# EAGLE design RH021.1 (EAGLE 7.1.0)
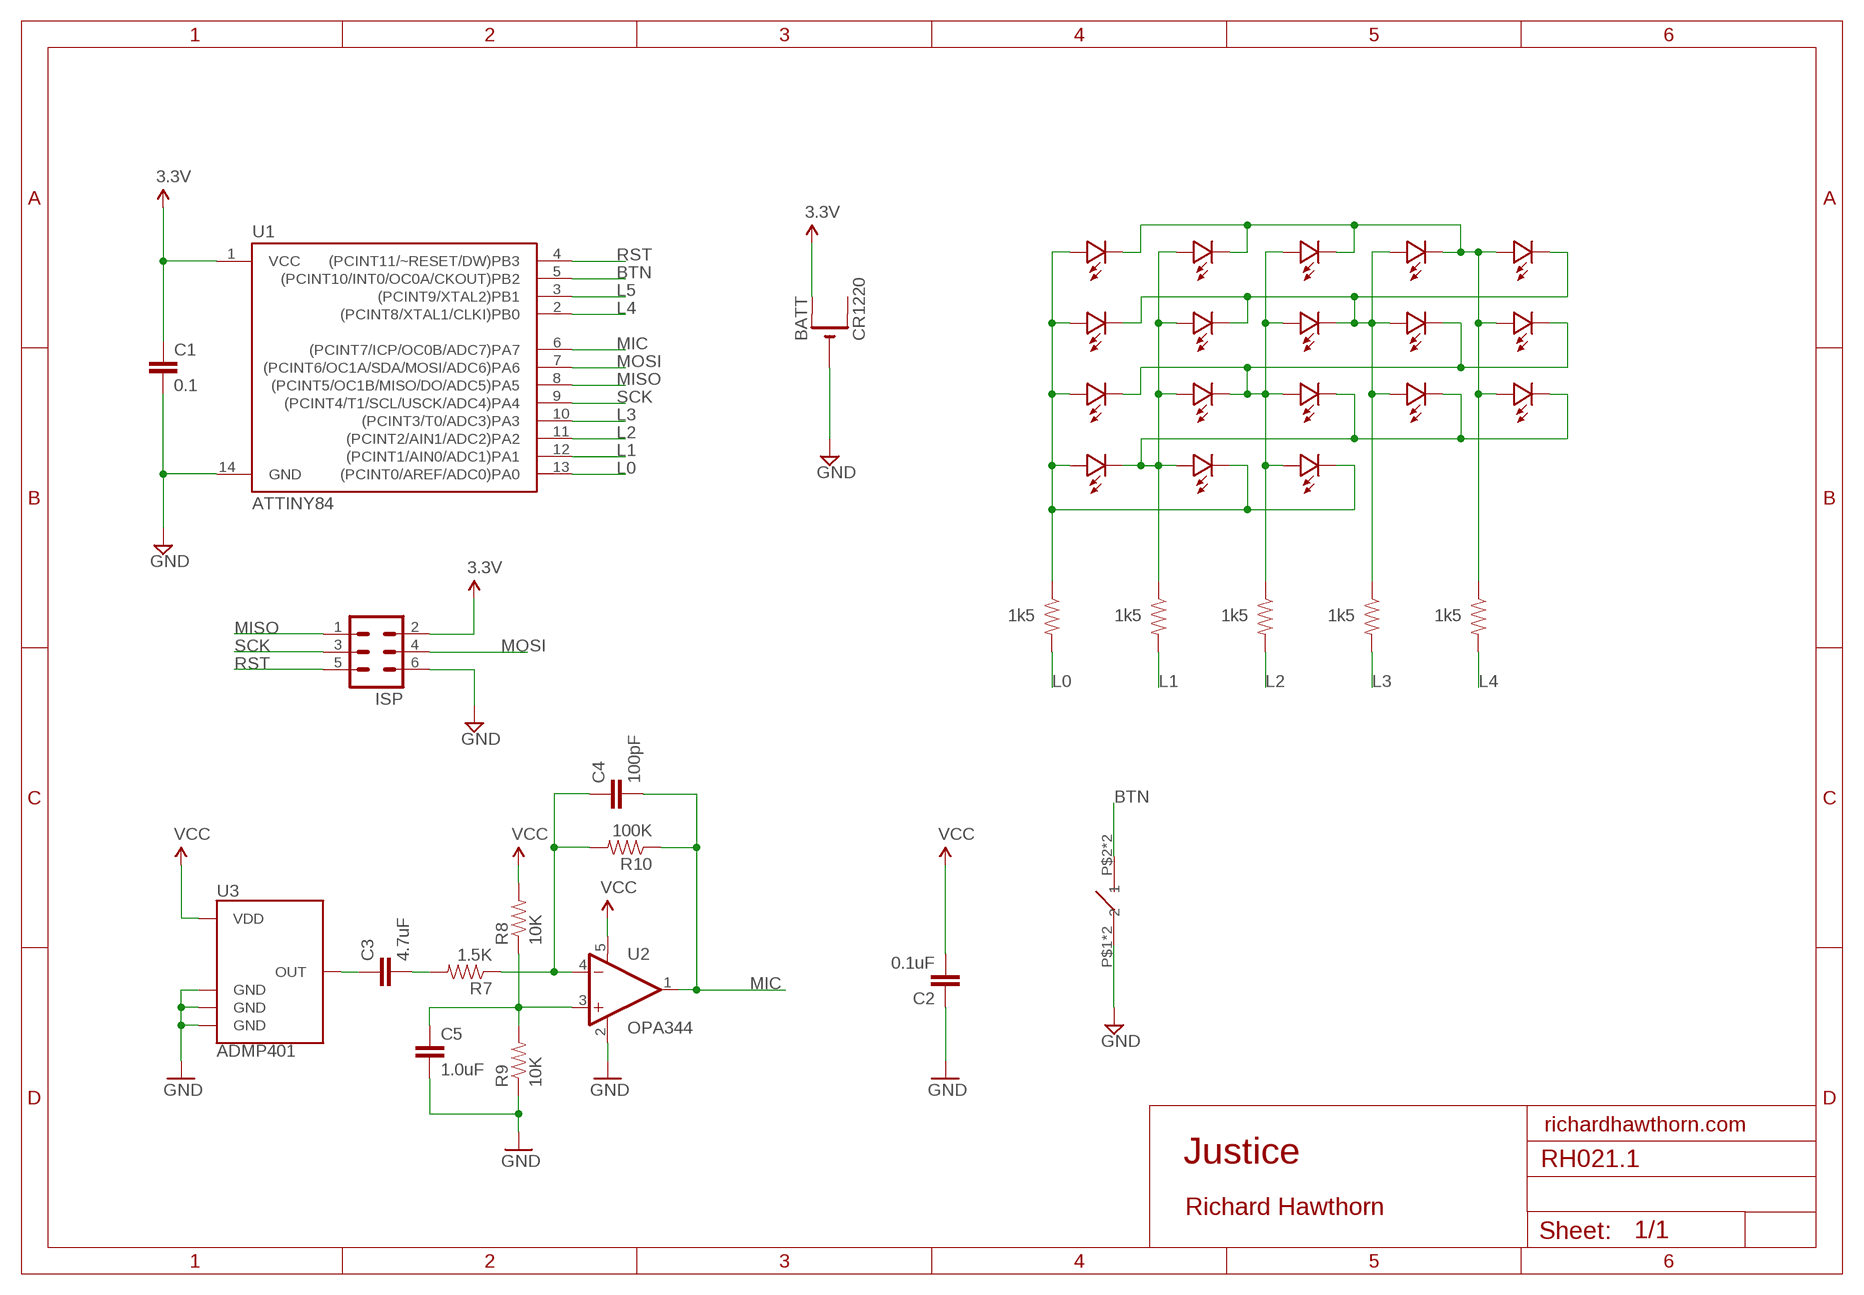
[diagram p0: schematic, sheet 1]

## Parts
BATT  CR1220  CR1220SMT  [CR1220-SMD]
BTN1  TURTLE-3PIN  [TURTLE-3PIN]
C1  0.1  CAP0603-CAP  [0603-CAP]
C2  0.1uF  CAP0402-CAP  [0402-CAP]
C3  4.7uF  CAP0402-CAP  [0402-CAP]
C4  100pF  CAP0402-CAP  [0402-CAP]
C5  1.0uF  CAP0402-CAP  [0402-CAP]
ISP  MA03-2  [MA03-2]
LED1  LED0603  [0603-LED]
LED2  LED0603  [0603-LED]
LED3  LED0603  [0603-LED]
LED4  LED0603  [0603-LED]
LED5  LED0603  [0603-LED]
LED6  LED0603  [0603-LED]
LED7  LED0603  [0603-LED]
LED8  LED0603  [0603-LED]
LED9  LED0603  [0603-LED]
LED10  LED0603  [0603-LED]
LED11  LED0603  [0603-LED]
LED12  LED0603  [0603-LED]
LED13  LED0603  [0603-LED]
LED14  LED0603  [0603-LED]
LED15  LED0603  [0603-LED]
LED16  LED0603  [0603-LED]
LED17  LED0603  [0603-LED]
LED18  LED0603  [0603-LED]
R1  1k5  RESISTOR0603-RES  [0603-RES]
R2  1k5  RESISTOR0603-RES  [0603-RES]
R3  1k5  RESISTOR0603-RES  [0603-RES]
R4  1k5  RESISTOR0603-RES  [0603-RES]
R5  1k5  RESISTOR0603-RES  [0603-RES]
R7  1.5K  RESISTOR0402-RES  [0402-RES]
R8  10K  RESISTOR0402-RES  [0402-RES]
R9  10K  RESISTOR0402-RES  [0402-RES]
R10  100K  RESISTOR0402-RES  [0402-RES]
U1  ATTINY84  [SO14]
U2  OPA344  [SOT23-5]
U3  ADMP401  [ADMP401]

## Nets
BTN: BTN1.P$2 BTN1.P$4 U1.5((PCINT10/INT0/OC0A/CKOUT)PB2)
C7N$1: C3.1 U3.1(OUT)
GND [power]: BATT.- BTN1.P$1 BTN1.P$3 C1.2 C2.1 C5.2 ISP.6 R9.1 U1.14(GND) U2.2(V-) U3.2(GND) U3.4(GND) U3.6(GND)
L0: R1.2 U1.13((PCINT0/AREF/ADC0)PA0)
L1: R2.2 U1.12((PCINT1/AIN0/ADC1)PA1)
L2: R3.2 U1.11((PCINT2/AIN1/ADC2)PA2)
L3: R4.2 U1.10((PCINT3/T0/ADC3)PA3)
L4: R5.2 U1.2((PCINT8/XTAL1/CLKI)PB0)
L5: U1.3((PCINT9/XTAL2)PB1)
MIC: C4.2 R10.1 U1.6((PCINT7/ICP/OC0B/ADC7)PA7) U2.1(OUT)
MISO: ISP.1 U1.8((PCINT5/OC1B/MISO/DO/ADC5)PA5)
MOSI: ISP.4 U1.7((PCINT6/OC1A/SDA/MOSI/ADC6)PA6)
N$2: C4.1 R7.1 R10.2 U2.4(-IN)
N$6: C3.2 R7.2
N$7: C5.1 R8.1 R9.2 U2.3(+IN)
N$12: LED2.PLUS LED7.PLUS LED12.PLUS LED13.MINUS LED14.MINUS LED15.MINUS LED16.MINUS LED17.PLUS R2.1
N$22: LED1.PLUS LED6.PLUS LED11.PLUS LED16.PLUS LED17.MINUS LED18.MINUS R1.1
N$32: LED1.MINUS LED2.MINUS LED3.MINUS LED4.MINUS LED5.PLUS LED10.PLUS LED15.PLUS R5.1
N$41: LED4.PLUS LED5.MINUS LED6.MINUS LED7.MINUS LED8.MINUS LED9.PLUS LED14.PLUS R4.1
N$50: LED3.PLUS LED8.PLUS LED9.MINUS LED10.MINUS LED11.MINUS LED12.MINUS LED13.PLUS LED18.PLUS R3.1
RST: ISP.5 U1.4((PCINT11/~RESET/DW)PB3)
SCK: ISP.3 U1.9((PCINT4/T1/SCL/USCK/ADC4)PA4)
VCC: BATT.+$1(+) C1.1 C2.2 ISP.2 R8.2 U1.1(VCC) U2.5(V+) U3.5(VDD) ; supply symbol labelled 3.3V
Unconnected: BATT.+$2(+1)

## Notes on the sheet
- richardhawthorn.com
- Justice
- Richard Hawthorn

## Library data of the parts
BATT = adafruit:CR1220: CR1216/CR1220/CR1225 12mm 3V lithium coin cell Great for battery packup. Both SMT and THM holders. Note the THM package has the ground pads on both sides of the PCB so that the masks are the same - this reduces the cost
BTN1 = Richards:TURTLE-3PIN
C1 = LowPowerLab:CAP: Capacitor Standard 0603 ceramic capacitor, and 0.1" leaded capacitor.
C2-C5 = SparkFun:CAP: Capacitor Standard 0603 ceramic capacitor, and 0.1" leaded capacitor.
ISP = Richards:MA03-2: PIN HEADER; OC_FARNELL: unknown; OC_NEWARK: unknown
LED1-LED18 = LowPowerLab:LED
R1-R5 = LowPowerLab:RESISTOR: Resistor
R7-R10 = SparkFun:RESISTOR: Resistor
U1 = SparkFun-DigitalIC:ATTINY84: Atmel 14-pin 2/4/8kB flash uC
U2 = SparkFun:OPA344
U3 = SparkFun:ADMP401

## Net classes
1 power: width 0.381 mm, clearance 0.254 mm

## Board
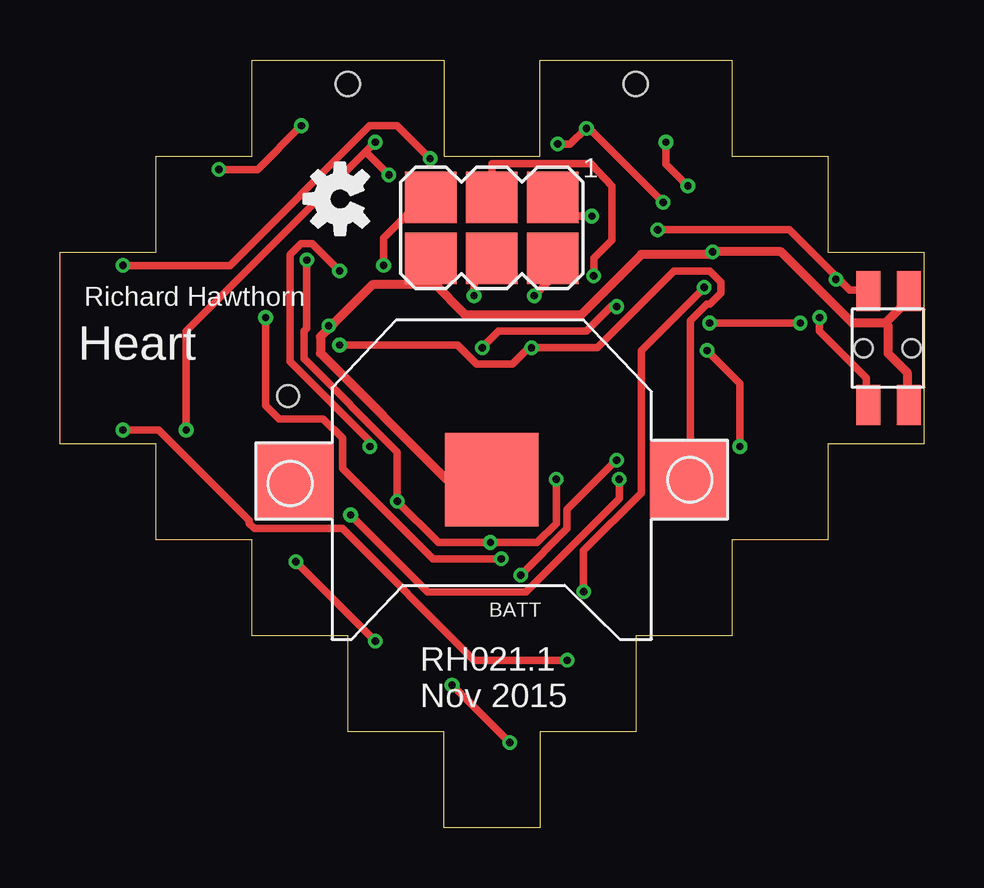
[diagram p1: board, top side]
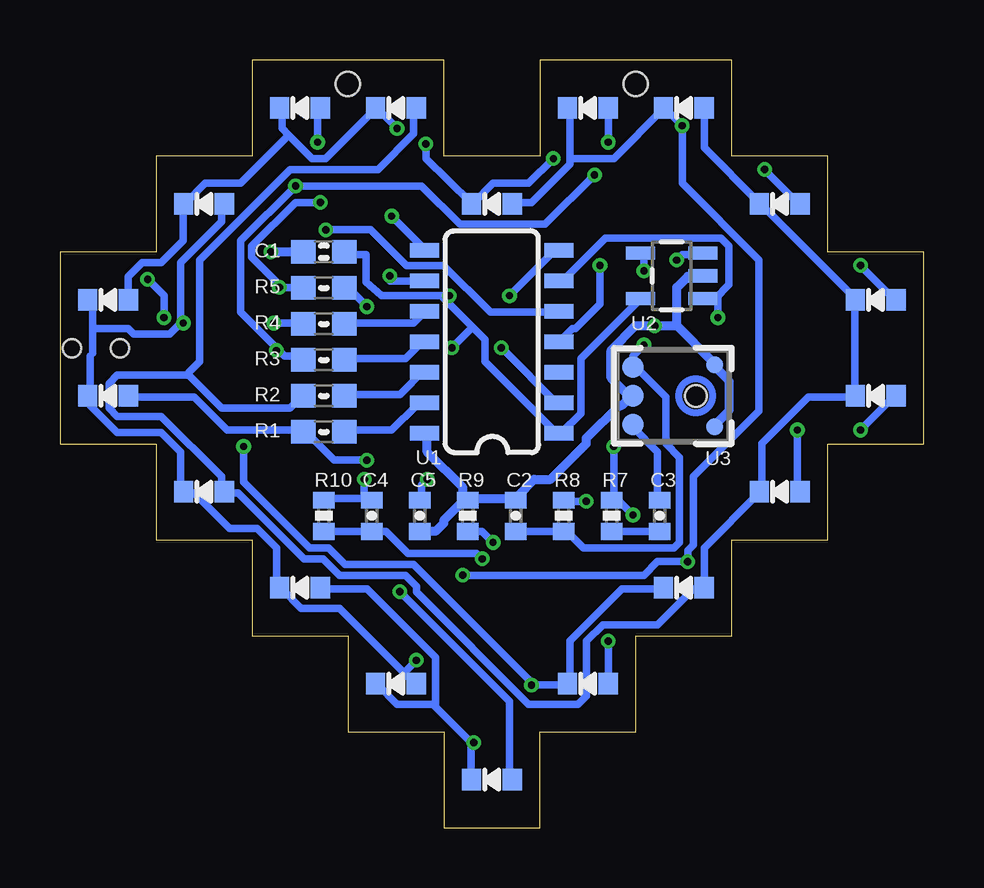
[diagram p2: board, bottom side, seen from below]

Size 36 x 32 mm. Coordinates in mm from the lower left corner, seen from the top.
Outline: 8,28 8,32 16,32 16,28 20,28 20,32 28,32 28,28 32,28 32,24 36,24 36,16 32,16 32,12 28,12 28,8 24,8 24,4 20,4 20,0 16,0 16,4 12,4 12,8 8,8 8,12 4,12 4,16 0,16 0,24 4,24 4,28 8,28
Copper layers (1*16): Top 0.035mm / dielectric 1.5mm / Bottom 0.035mm
Design rules "ITEADstudio_DRC *": minimum track width 12mil, minimum drill 12mil, track to track 6mil, track to pad 6mil, pad to pad 6mil, via to via 6mil, smd to smd 0mil, copper to edge 10mil, drill to drill 10mil, minimum pad ring 10mil, minimum via ring 6mil, stop-mask expansion 2mil, vias tented up to drill 100mil, thermal gap 15mil
Holes 1 mm at 12,31 24,31
tRestrict: area 24.3,8.9 to 29.1,12.8; area 5.8,16.9 to 6.9,18.5; area 5.2,9.7 to 6.7,10.4
bRestrict: area 27.4,17.7 to 29.2,18.7; area 21.1,13.8 to 22.9,14.9; area 21.6,12.6 to 22.1,13.2; area 20.7,12.6 to 21.2,13.2; area 20.2,12.8 to 20.7,13.5; area 20.1,13.4 to 20.6,14; area 26.5,18.9 to 27.1,19.5; area 26.5,17.9 to 27.1,18.5; area 27.5,19.1 to 28,19.8; area 27.9,18.8 to 29.1,19.6

### Footprints (pad centres in the part's own frame; a part is rotated, then mirrored left to right if it is on the bottom)
CR1220-SMD = smd 3.2 x 3.2: +$1 -8.2,0; +$2 8.2,0 | smd 3.9 x 3.9: - 0,0
TURTLE-3PIN = smd 1.676 x 1: P$1 -2.39,-0.889; P$2 -2.39,0.811; P$3 2.36,-0.889; P$4 2.36,0.811 | hole 0.75: -0.015,-1; -0.015,1
0603-CAP = smd 1.016 x 0.965: 1 -0.85,0; 2 0.85,0
0402-CAP = smd 0.7 x 0.9: 1 -0.65,0; 2 0.65,0
MA03-2 = smd 2.159 x 2.159: 1 -2.54,-1.27; 2 -2.54,1.27; 3 0,-1.27; 4 0,1.27; 5 2.54,-1.27; 6 2.54,1.27
0603-LED = smd 0.8 x 0.9: MINUS -0.85,0; PLUS 0.85,0
0603-RES = smd 1.016 x 0.965: 1 -0.85,0; 2 0.85,0
0402-RES = smd 0.7 x 0.9: 1 -0.65,0; 2 0.65,0
SO14 = smd 0.6 x 1.2: 1 -3.81,-2.8; 2 -2.54,-2.8; 3 -1.27,-2.8; 4 0,-2.8; 5 1.27,-2.8; 6 2.54,-2.8; 7 3.81,-2.8; 8 3.81,2.8; 9 2.54,2.8; 10 1.27,2.8; 11 0,2.8; 12 -1.27,2.8; 13 -2.54,2.8; 14 -3.81,2.8
SOT23-5 = smd 0.55 x 1.2: 1 -0.95,-1.3; 2 0,-1.3; 3 0.95,-1.3; 4 0.95,1.3; 5 -0.95,1.3
ADMP401 = smd 0.9 x 0.9: 1 -1.2,2.62; 5 1.2,2.62; 6 0,2.62 | smd 0.7 x 0.7: 2 1.3,-0.8; 4 -1.3,-0.8 | hole 0.9: 0,0

### Placement (x,y rotation side)
BATT  18,14.5 180 top
BTN1  34.5,20 90 top
C1  25,24 180 bottom
C2  17,13 270 bottom
C3  11,13 270 bottom
C4  23,13 270 bottom
C5  21,13 270 bottom
ISP  18,25 180 top
LED1  18,26 0 bottom
LED2  22,30 0 bottom
LED3  26,30 0 bottom
LED4  30,26 0 bottom
LED5  34,22 0 bottom
LED6  34,18 0 bottom
LED7  30,14 0 bottom
LED8  26,10 0 bottom
LED9  22,6 0 bottom
LED10  18,2 0 bottom
LED11  14,6 0 bottom
LED12  10,10 0 bottom
LED13  6,14 0 bottom
LED14  2,18 0 bottom
LED15  2,22 0 bottom
LED16  6,26 0 bottom
LED17  10,30 0 bottom
LED18  14,30 0 bottom
R1  25,16.5 0 bottom
R2  25,18 0 bottom
R3  25,19.5 0 bottom
R4  25,21 0 bottom
R5  25,22.5 0 bottom
R7  13,13 270 bottom
R8  15,13 270 bottom
R9  19,13 270 bottom
R10  25,13 90 bottom
U1  18,20.25 90 bottom
U2  10.5,23 90 bottom
U3  9.5,18 90 bottom
U$3  [OSHW-LOGO-S]  11.67,26.21 90 top

### Tracks (layer width: path | path; a pad name or v marks a point on that pad's centre or on a via)
BTN  (via drill 0.3)
  Top 0.305: v24.92,24.92 30.4,24.92 32.4,22.92 | 32.4,22.92 32.92,22.4 33.6,22.4 BTN1.P$4 | v31.66,21.26 31.66,20.69 33.6,18.75 33.6,17.72 BTN1.P$2 | v32.35,22.86 32.4,22.92
  Bottom 0.305: v24.92,24.92 23.05,24.92 21.56,23.43 20,23.43 18.06,21.49 15.2,21.49 U1.5 | v31.66,21.26 31.66,22.17 v32.35,22.86
C7N$1
  Bottom 0.305: C3.1 11.09,13.72 11.09,15.66 12.12,16.69 U3.1
GND  (via drill 0.3)
  Top 0.381: 34.4,21.03 33.03,21.03 30.06,24 v27.2,24 27.09,23.89 24.23,23.89 21.72,21.37 16.92,21.37 15.54,22.75 | 34.4,21.03 35.32,21.95 35.32,22.29 BTN1.P$3 | BTN1.P$1 35.32,17.72 35.32,18.97 34.52,19.77 34.52,20.92 34.4,21.03 | 15.54,22.75 15.54,23.66 ISP.6 | 11.26,20.86 13.03,22.63 15.43,22.63 15.54,22.75 | 11.26,20.86 10.86,20.46 10.86,19.77 16.12,14.52 17.95,14.52 BATT.- | v11.2,20.92 11.26,20.86
  Bottom 0.381: U3.4 8.69,16.8 8.12,17.37 8.12,18.63 8.69,19.2 U3.2 8.8,19.43 10.29,20.92 | 10.29,20.92 10.29,22.52 9.83,22.97 9.26,22.97 U2.2 | R9.1 18.97,13.72 17.03,13.72 C2.1 16.92,13.83 16.23,14.52 15.54,14.52 14.06,16 14.06,16.23 12.69,17.6 12.57,17.6 12.23,17.95 U3.6 12.34,18.06 13.03,18.75 13.03,19.89 12,20.92 v11.2,20.92 10.29,20.92 | C5.2 20.92,12.34 20.34,12.34 20,12.69 20,12.8 19.09,13.72 R9.1 | U1.14 20.69,16.34 20.69,15.66 19.2,14.17 19.2,13.83 R9.1 | v27.2,24 25.95,24 C1.2
L0
  Bottom 0.305: R1.2 24.12,16.57 22.17,16.57 21.14,17.6 20.8,17.6 U1.13
L1
  Bottom 0.305: R2.2 24.12,18.06 21.83,18.06 20.8,19.09 U1.12
L2
  Bottom 0.305: R3.2 24.12,19.55 21.6,19.55 20.8,20.34 U1.11
L3
  Bottom 0.305: R4.2 24.12,21.03 21.26,21.03 20.8,21.49 U1.10
L4  (via drill 0.3)
  Top 0.305: v23.2,21.72 22.97,21.72 21.95,20.69 18.29,20.69 v17.6,20
  Bottom 0.305: v23.2,21.72 23.89,22.4 24.12,22.4 R5.2 | v17.6,20 15.2,17.6 U1.2
MIC  (via drill 0.3)
  Top 0.305: v18.4,11.2 15.54,11.2 11.77,14.97 11.77,16.23 10.97,17.03 9.14,17.03 8.57,17.6 v8.57,21.26
  Bottom 0.305: R10.1 24.92,12.34 23.09,12.34 C4.2 22.86,12.34 22.4,12.34 21.49,11.43 18.63,11.43 v18.4,11.2 | 8.69,22.06 9.14,22.06 U2.1 | 8.69,22.06 8.12,22.63 8.12,24.23 8.46,24.57 13.26,24.57 15.09,22.75 U1.6 | v8.57,21.26 8.57,22.06 8.69,22.06
MISO  (via drill 0.3)
  Top 0.305: v22.17,25.49 21.26,25.49 20.57,26.18 ISP.1
  Bottom 0.305: v22.17,25.49 20.8,24.12 U1.8
MOSI  (via drill 0.3)
  Top 0.305: v17.26,22.17 17.26,22.97 17.95,23.66 ISP.4
  Bottom 0.305: v17.26,22.17 15.43,24 15.2,24 U1.7
N$2  (via drill 0.3)
  Top 0.305: v12.92,15.89 12.92,16.12 9.6,19.43 9.6,23.89 10.06,24.35 10.52,24.35 v11.66,23.2 | v23.32,14.52 23.32,13.72 19.43,9.83 15.32,9.83 v12.12,13.03
  Bottom 0.305: R10.2 24.92,13.72 23.09,13.72 C4.1 23.32,13.83 v23.32,14.52 | v12.92,15.89 12.92,13.72 R7.1 12.8,13.72 v12.12,13.03 | v11.66,23.2 11.66,23.77 11.77,23.89 U2.4
N$6
  Bottom 0.305: C3.2 11.09,12.34 12.92,12.34 R7.2
N$7  (via drill 0.3)
  Top 0.305: v20.69,14.52 20.69,12.69 19.89,11.89 v17.95,11.89 15.77,11.89 v14.06,13.6 14.06,15.66 10.17,19.55 10.17,20.69 10.29,20.8 v10.29,23.66
  Bottom 0.305: v17.95,11.89 18.4,12.34 18.97,12.34 R9.2 | v14.06,13.6 14.97,13.6 R8.1 | v20.69,14.52 20.92,14.29 20.92,13.72 C5.1 | v10.29,23.66 10.06,23.89 9.26,23.89 U2.3
N$12
  Bottom 0.305: LED15.MINUS 2.86,21.95 2.86,18.06 LED14.MINUS 2.97,17.95 4.8,17.95 6.74,16 6.74,14.06 LED13.MINUS 6.86,13.95 9.14,11.66 9.14,10.06 LED12.PLUS 9.26,9.94 9.6,9.94 11.09,8.46 13.37,8.46 14.06,7.77 14.06,5.49 14.4,5.14 16.46,5.14 21.14,9.83 21.14,10.06 21.6,10.52 24.35,10.52 25.03,11.2 25.83,11.2 28.57,13.95 29.03,13.95 LED7.PLUS 29.26,14.06 29.26,14.63 31.77,17.14 33.6,17.14 33.95,17.49 33.95,18.52 33.6,18.86 30.63,18.86 | 2.97,22.06 LED15.MINUS | 30.63,18.86 29.26,17.49 26.4,17.49 25.95,17.95 R2.1 | LED2.PLUS 21.26,29.95 21.26,28.92 22.75,27.43 26.4,27.43 30.18,23.66 30.18,19.43 30.63,18.97 30.63,18.86 | LED17.PLUS 9.14,29.95 9.14,28.35 6.86,26.06 LED16.MINUS 6.74,25.95 2.97,22.17 LED15.MINUS
N$22  (via drill 0.3)
  Top 0.305: v9.83,11.09 v13.14,7.77 | v23.2,15.32 21.14,13.26 21.14,12.46 v19.2,10.52 | v6.63,27.43 8.23,27.43 v10.06,29.26
  Bottom 0.305: LED6.PLUS 33.15,17.95 30.4,17.95 29.03,16.57 25.95,16.57 R1.1 25.72,16.46 24.57,15.32 v23.2,15.32 | v13.14,7.77 13.14,6.06 LED11.PLUS | v19.2,10.52 11.66,10.52 11.09,11.09 v9.83,11.09 9.83,11.54 9.6,11.77 9.6,14.63 6.86,17.37 6.86,23.66 10.06,26.86 v10.06,29.26 10.74,29.95 LED17.MINUS 10.86,29.95 12.92,27.89 14.74,27.89 | 14.74,27.89 14.74,27.66 16.34,26.06 17.14,26.06 LED1.PLUS | 14.74,27.89 14.74,29.95 LED18.MINUS | v6.63,27.43 5.26,26.06 LED16.PLUS
N$32  (via drill 0.3)
  Top 0.305: v21.83,9.83 21.83,11.54 24.23,13.95 24.23,19.89 v26.86,22.52 | v2.63,23.43 7.09,23.43 12.92,29.26 14.06,29.26 v15.43,27.89 | v20.75,28.5 21.25,28.5 v21.95,29.15 22.06,29.15 v25.15,26.06
  Bottom 0.305: v21.83,9.83 17.26,5.26 17.26,2.06 LED10.PLUS | R5.1 25.95,22.52 v26.86,22.52 26.86,22.63 28,23.77 28,24.23 26.18,26.06 v25.15,26.06 | 26.46,28.86 26.75,29.15 26.75,29.95 LED3.MINUS | 26.46,28.86 25.49,27.89 24.92,27.89 22.86,29.95 LED2.MINUS 22.75,29.95 v21.95,29.15 | LED5.PLUS 33.15,22.06 33.15,22.97 32.58,23.55 31.77,23.55 30.86,24.46 30.86,25.95 LED4.MINUS 30.75,26.06 29.95,26.86 28.46,26.86 26.46,28.86 | v2.63,23.43 1.26,22.06 LED15.PLUS | v15.43,27.89 16.46,26.86 17.95,26.86 18.75,26.06 LED1.MINUS 18.86,26.06 20.75,27.89 v20.75,28.5
N$41  (via drill 0.3)
  Top 0.305: v30.86,21.03 v27.09,21.03 | v2.63,16.57 4.12,16.57 7.89,12.8 7.89,12.69 8.12,12.46 11.77,12.46 17.26,6.97 v21.14,6.97
  Bottom 0.305: 34.63,20.8 34.63,21.83 34.75,21.95 LED5.MINUS | 34.63,20.8 34.63,19.77 34.75,19.66 34.75,18.06 LED6.MINUS 34.75,17.95 34.75,17.6 33.6,16.46 31.77,16.46 30.98,15.66 30.98,14.06 LED7.MINUS 30.75,13.95 30.4,13.95 28.92,12.46 27.77,12.46 26.98,11.66 26.98,10.06 LED8.MINUS 26.75,9.94 25.95,9.14 24.35,9.14 21.66,6.46 | 30.98,21.03 30.98,23.55 29.26,25.26 29.26,25.95 LED4.PLUS | 30.98,21.03 31.43,20.57 32.92,20.57 33.15,20.8 34.63,20.8 | v27.09,21.03 25.95,21.03 R4.1 | v30.86,21.03 30.98,21.03 | 21.66,6.46 21.26,6.06 LED9.PLUS | v2.63,16.57 1.26,17.95 LED14.PLUS | 21.66,6.46 v21.14,6.97
N$50  (via drill 0.3)
  Top 0.305: v18.75,3.54 v16.34,5.94 | v25.26,28.57 25.26,27.66 v26.18,26.75 | v5.26,16.57 5.26,20.69 12.74,28.18 | v13.14,28.57 12.74,28.18 | 12.74,28.18 v13.72,27.2 | v28.35,15.89 28.35,18.52 v26.98,19.89
  Bottom 0.305: LED12.MINUS 10.86,9.94 12.57,9.94 14.74,7.77 14.74,6.06 LED11.MINUS 14.97,5.94 v16.34,5.94 16.34,6.06 21.26,10.97 24.12,10.97 24.8,11.66 25.6,11.66 28.35,14.4 v28.35,15.89 | 18.86,3.54 18.86,2.06 LED10.MINUS | 20.4,5.09 20.46,5.14 21.95,5.14 22.75,5.94 LED9.MINUS | 20.4,5.09 18.86,3.54 | LED8.PLUS 25.15,9.94 23.2,9.94 20.34,7.09 20.34,5.14 20.4,5.09 | v18.75,3.54 18.86,3.54 | v25.26,28.57 25.26,29.95 LED3.PLUS | 26.92,19.95 26.63,19.66 26.06,19.66 25.95,19.55 R3.1 | 26.92,19.95 28.46,21.49 28.46,24.46 v26.18,26.75 20.92,26.75 19.32,25.15 15.77,25.15 v13.72,27.2 | v5.26,16.57 5.26,14.06 LED13.PLUS | v13.14,28.57 13.14,29.95 LED18.PLUS | v26.98,19.89 26.92,19.95
RST  (via drill 0.3)
  Top 0.305: v13.49,23.43 13.49,24.57 15.09,26.18 15.43,26.18 ISP.5
  Bottom 0.305: v13.49,23.43 13.49,21.83 14.52,20.8 14.63,20.8 15.09,20.34 U1.4
SCK  (via drill 0.3)
  Top 0.305: v22.25,23 22.25,23.75 23,24.5 23,26.75 22.12,27.67 18,27.67 ISP.3
  Bottom 0.305: U1.9 22.25,22.79
  Bottom 0.31: 22.25,22.79 v22.25,23
VCC  (via drill 0.3)
  Top 0.305: v19.77,22.17 20.46,22.86 20.46,23.66 ISP.2 | BATT.+$1 26.29,14.52 26.29,21.14 26.98,21.83 27.09,21.83 27.55,22.29 27.55,22.75 27.09,23.2 25.6,23.2 22.4,20 v19.66,20 19.55,20 18.86,19.32 17.37,19.32 16.57,20.12 v11.66,20.12
  Bottom 0.305: C2.2 16.92,12.34 15.09,12.34 R8.2 14.86,12.34 14.17,11.66 10.4,11.66 10.17,11.89 10.17,15.43 10.74,16 10.74,17.95 11.89,19.09 12.12,19.09 U3.5 12.12,19.32 12.12,19.66 v11.66,20.12 | 18.8,20.86 18.29,20.34 18.29,19.43 15.2,16.34 U1.1 15.09,16.46 14.29,17.26 14.29,19.55 11.89,21.95 U2.5 | 18.8,20.86 19.95,22 | 19.95,22 20.12,22.17 22.6,22.17 23.25,22.75 23.25,23.89 24.12,23.89 C1.1 | 19.95,22 v19.77,22.17 | 18.8,20.86 v19.66,20

### Text on the board
tNames: Richard Hawthorn | Heart | RH021.1 / Nov 2015
tDocu: REG